# Altium schematic sheet [5]-MCU_CONNECTORS.SchDoc
size A4
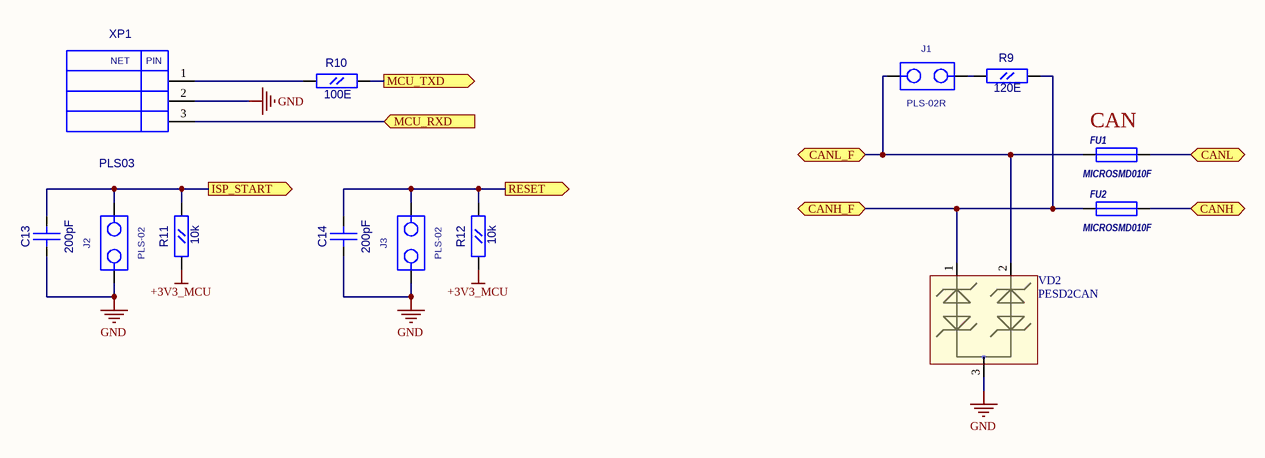
[diagram p0: [5]-MCU_CONNECTORS.SchDoc]

## Parts
C13  200pF  [CC0603]
C14  200pF  [CC0603]
FU1  MICROSMD010F  [RC1210]
FU2  MICROSMD010F  [RC1210]
J1  PLS-02R  [PLS-02R]
J2  PLS-02  [PLS-02]
J3  PLS-02  [PLS-02]
R9  120E  [RC0805]
R10  100E  [RC0603]
R11  10k  [RC0603]
R12  10k  [RC0603]
VD2  PESD2CAN  [SOT-23(123)]
XP1  PLS03  [PLS-03]

## Ports
CANH (bidir), CANH_F (bidir), CANL (bidir), CANL_F (bidir), ISP_START (out), MCU_RXD (in), MCU_TXD (out), RESET (out)

## Nets
+3V3_MCU: R11.1(A) R12.1(A)
GND: C13.1(A) C14.1(A) J2.1 J3.1 VD2.3 XP1.2
CANH: FU2.2 ; port CANH
CANH_F: FU2.1 R9.2(B) VD2.1 ; port CANH_F
CANL: FU1.2 ; port CANL
CANL_F: FU1.1 J1.1 VD2.2 ; port CANL_F
ISP_START: C13.2(B) J2.2 R11.2(B) ; port ISP_START
MCU_RXD: XP1.3 ; port MCU_RXD
MCU_TXD: R10.2(B) ; port MCU_TXD
RESET: C14.2(B) J3.2 R12.2(B) ; port RESET
NetJ1_2: J1.2 R9.1(A)
NetR10_1: R10.1(A) XP1.1

## Notes on the sheet
- (near FU1) CAN
- (in symbol PLS03) NET; PIN

## Library data of the parts
C13 C14 = CC0603: Value: 200pF
FU1 FU2 = MICROSMD: Value: *
R9 = RC0805: Value: 120E
R10-R12 = RC0603
  R10: Value: 100E
  R11 R12: Value: 10k
VD2 = PESD2CAN: TVS for CAN
J1 = PLS-02R: Value: *
J2 J3 = PLS-02: Value: *
XP1 = PLS03: Value: *